# EAGLE design POV_2.0 (EAGLE 6.6.0)
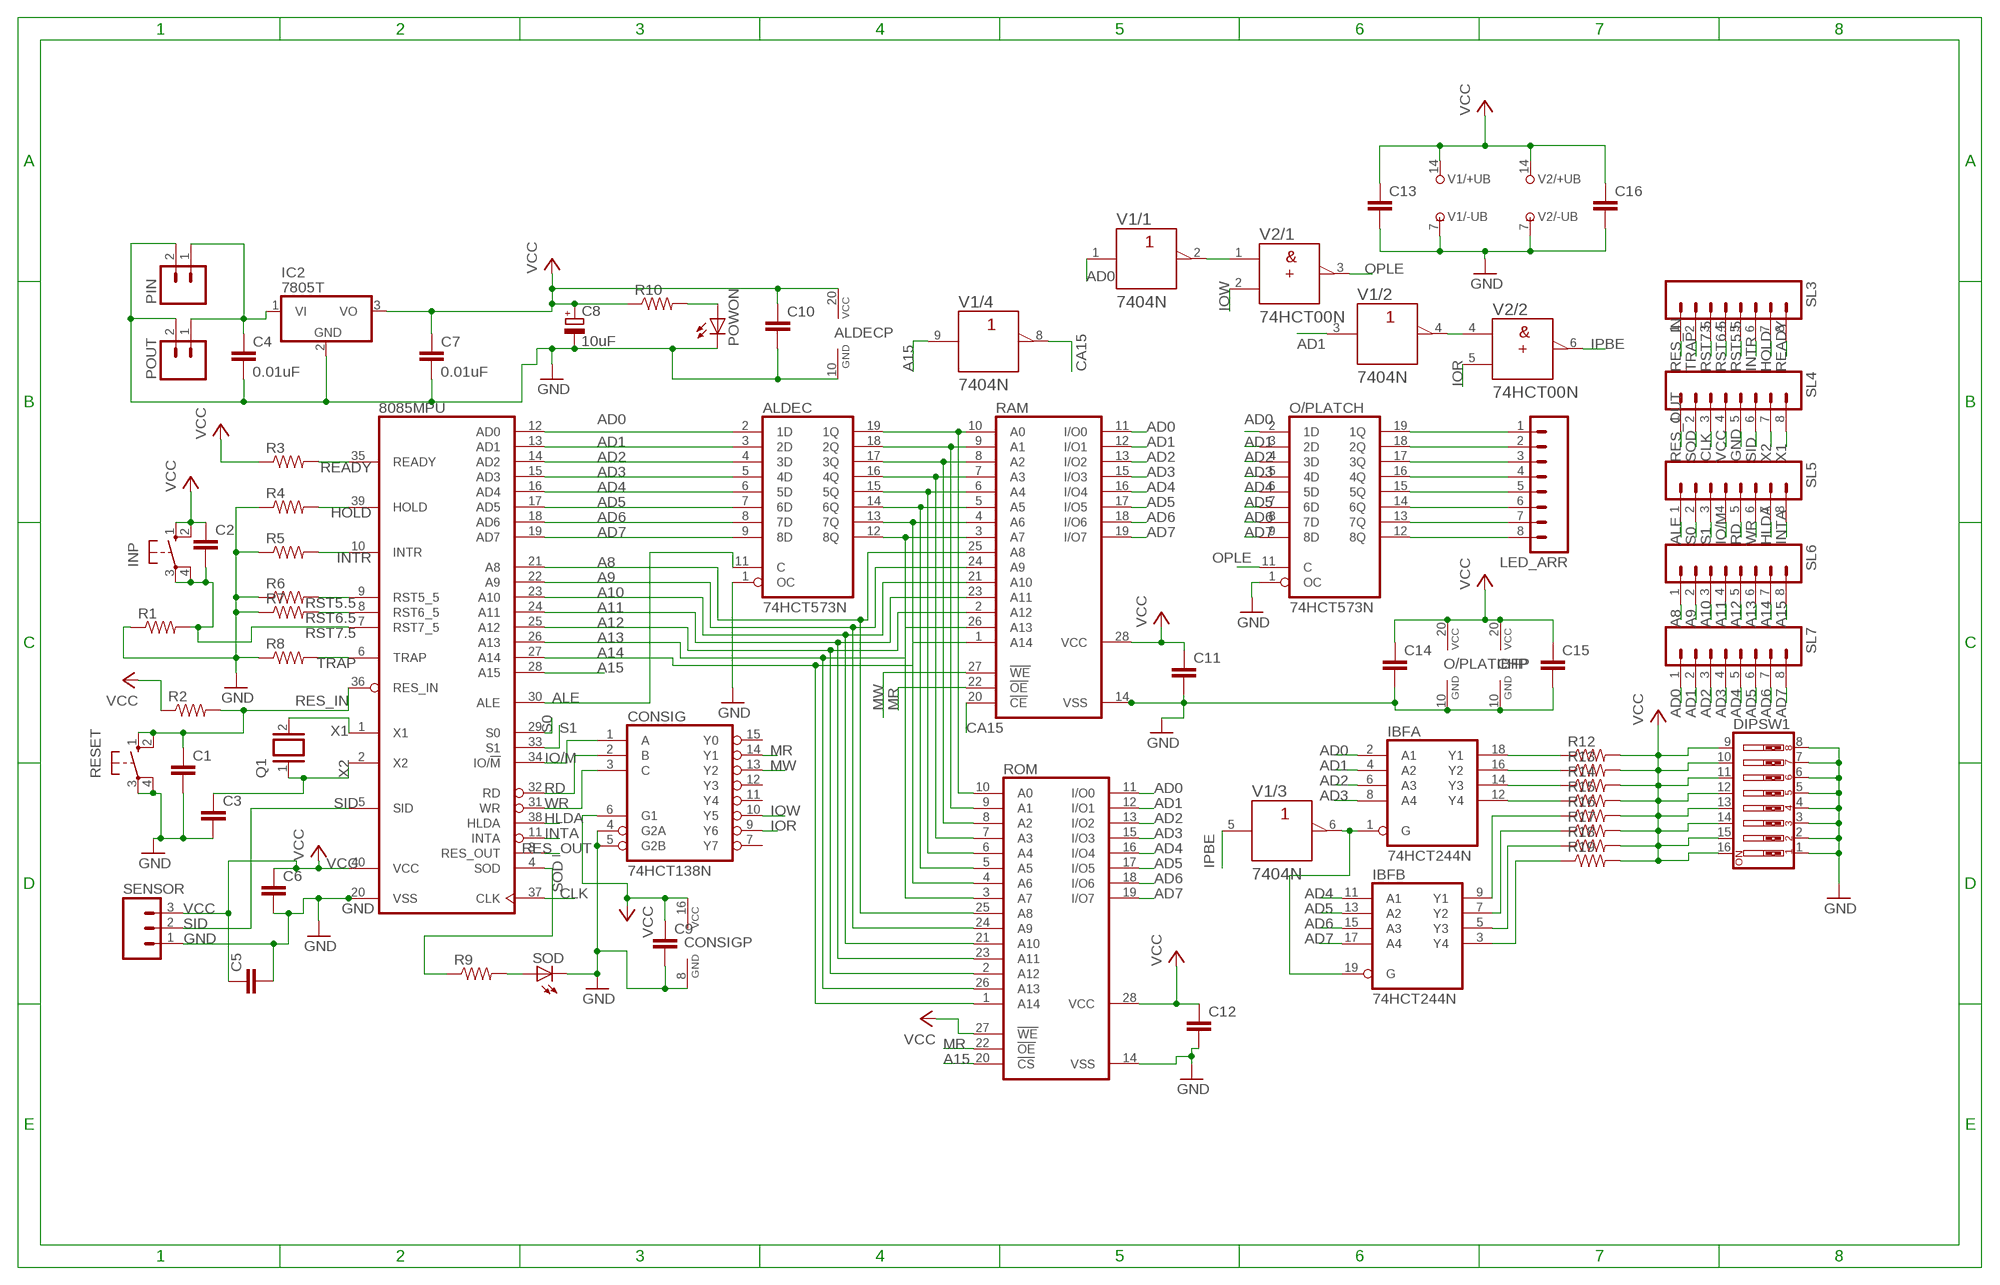
[diagram p0: schematic, sheet 1]

## Parts
8085MPU  8085  [DIL40]
ALDEC  74HCT573N  [DIL20]
C1  C-EU025-024X044  [C025-024X044]
C2  C-EU025-024X044  [C025-024X044]
C3  C-EU025-024X044  [C025-024X044]
C4  0.01uF  C-EU025-024X044  [C025-024X044]
C5  C-EU025-024X044  [C025-024X044]
C6  C-EU025-024X044  [C025-024X044]
C7  0.01uF  C-EU025-024X044  [C025-024X044]
C8  10uF  CPOL-EUE2,5-6E  [E2,5-6E]
C9  C-EU025-024X044  [C025-024X044]
C10  C-EU025-024X044  [C025-024X044]
C11  C-EU025-024X044  [C025-024X044]
C12  C-EU025-024X044  [C025-024X044]
C13  C-EU025-024X044  [C025-024X044]
C14  C-EU025-024X044  [C025-024X044]
C15  C-EU025-024X044  [C025-024X044]
C16  C-EU025-024X044  [C025-024X044]
CONSIG  74HCT138N  [DIL16]
DIPSW1  SW_DIP-8  [EDG-08]
IBF  74HCT244N  [DIL20]
IC2  7805T  [TO220H]
INP  10-XX  [B3F-10XX]
LED_ARR  M08  [08P]
O/PLATCH  74HCT573N  [DIL20]
PIN  M02  [02P]
POUT  M02  [02P]
POWON  LED5MM  [LED5MM]
Q1  XTAL/S  [QS]
R1  R-US_0204/7  [0204/7]
R2  R-US_0204/7  [0204/7]
R3  R-US_0204/7  [0204/7]
R4  R-US_0204/7  [0204/7]
R5  R-US_0204/7  [0204/7]
R6  R-US_0204/7  [0204/7]
R7  R-US_0204/7  [0204/7]
R8  R-US_0204/7  [0204/7]
R9  R-US_0204/7  [0204/7]
R10  R-US_0204/7  [0204/7]
R12  R-US_0204/7  [0204/7]
R13  R-US_0204/7  [0204/7]
R14  R-US_0204/7  [0204/7]
R15  R-US_0204/7  [0204/7]
R16  R-US_0204/7  [0204/7]
R17  R-US_0204/7  [0204/7]
R18  R-US_0204/7  [0204/7]
R19  R-US_0204/7  [0204/7]
RAM  58C256P  [DIL28-6]
RESET  10-XX  [B3F-10XX]
ROM  62256P  [DIL28-6]
SENSOR  M03  [03P]
SL3  M08  [08P]
SL4  M08  [08P]
SL5  M08  [08P]
SL6  M08  [08P]
SL7  M08  [08P]
SOD  LED5MM  [LED5MM]
V1  7404N  [DIL14]
V2  74HCT00N  [DIL14]

## Nets
A8: 8085MPU.21(A8) RAM.25(A8) ROM.25(A8) SL6.1
A9: 8085MPU.22(A9) RAM.24(A9) ROM.24(A9) SL6.2
A10: 8085MPU.23(A10) RAM.21(A10) ROM.21(A10) SL6.3
A11: 8085MPU.24(A11) RAM.23(A11) ROM.23(A11) SL6.4
A12: 8085MPU.25(A12) RAM.2(A12) ROM.2(A12) SL6.5
A13: 8085MPU.26(A13) RAM.26(A13) ROM.26(A13) SL6.6
A14: 8085MPU.27(A14) RAM.1(A14) ROM.1(A14) SL6.7
A15: 8085MPU.28(A15) ROM.20(!CS) SL6.8 V1.9(/4:A)
AD0: 8085MPU.12(AD0) ALDEC.2(1D) IBF.2(A:A1) O/PLATCH.2(1D) RAM.11(I/O0) ROM.11(I/O0) SL7.1 V1.1(/1:A)
AD1: 8085MPU.13(AD1) ALDEC.3(2D) IBF.4(A:A2) O/PLATCH.3(2D) RAM.12(I/O1) ROM.12(I/O1) SL7.2 V1.3(/2:A)
AD2: 8085MPU.14(AD2) ALDEC.4(3D) IBF.6(A:A3) O/PLATCH.4(3D) RAM.13(I/O2) ROM.13(I/O2) SL7.3
AD3: 8085MPU.15(AD3) ALDEC.5(4D) IBF.8(A:A4) O/PLATCH.5(4D) RAM.15(I/O3) ROM.15(I/O3) SL7.4
AD4: 8085MPU.16(AD4) ALDEC.6(5D) IBF.11(B:A1) O/PLATCH.6(5D) RAM.16(I/O4) ROM.16(I/O4) SL7.5
AD5: 8085MPU.17(AD5) ALDEC.7(6D) IBF.13(B:A2) O/PLATCH.7(6D) RAM.17(I/O5) ROM.17(I/O5) SL7.6
AD6: 8085MPU.18(AD6) ALDEC.8(7D) IBF.15(B:A3) O/PLATCH.8(7D) RAM.18(I/O6) ROM.18(I/O6) SL7.7
AD7: 8085MPU.19(AD7) ALDEC.9(8D) IBF.17(B:A4) O/PLATCH.9(8D) RAM.19(I/O7) ROM.19(I/O7) SL7.8
ALE: 8085MPU.30(ALE) ALDEC.11(C) SL5.1
CA15: RAM.20(!CE) V1.8(/4:Y)
CLK: 8085MPU.37(CLK) SL4.3
GND: 8085MPU.20(VSS) ALDEC.1(OC) ALDEC.10(GND) C1.2 C3.2 C4.2 C5.2 C6.2 C7.2 C8.- C9.2 C10.2 C11.2 C12.2 C13.2 C14.2 C15.2 C16.2 CONSIG.4(G2A) CONSIG.5(G2B) CONSIG.8(GND) DIPSW1.1 DIPSW1.2 DIPSW1.3 DIPSW1.4 DIPSW1.5 DIPSW1.6 DIPSW1.7 DIPSW1.8 IBF.10(P:GND) IC2.2(GND) O/PLATCH.1(OC) O/PLATCH.10(GND) PIN.2 POUT.2 POWON.K(C) R1.1 R4.1 R5.1 R6.1 R7.1 R8.1 RAM.14(VSS) RESET.3(P) RESET.4(P1) ROM.14(VSS) SENSOR.1 SL4.5 SOD.K(C) V1.7(/-UB:-UB) V2.7(/-UB:-UB)
HLDA: 8085MPU.38(HLDA) SL5.7
HOLD: 8085MPU.39(HOLD) R4.2 SL3.7
INTA: 8085MPU.11(INTA) SL5.8
INTR: 8085MPU.10(INTR) R5.2 SL3.6
IO/M: 8085MPU.34(IO/!M) CONSIG.1(A) SL5.4
IOR: CONSIG.9(Y6) V2.5(/2:B)
IOW: CONSIG.10(Y5) V2.2(/1:B)
IPBE: V1.5(/3:A) V2.6(/2:Y)
MR: CONSIG.14(Y1) RAM.22(!OE) ROM.22(!OE)
MW: CONSIG.13(Y2) RAM.27(!WE)
N$1: LED_ARR.1 O/PLATCH.19(1Q)
N$2: LED_ARR.2 O/PLATCH.18(2Q)
N$3: LED_ARR.3 O/PLATCH.17(3Q)
N$4: LED_ARR.4 O/PLATCH.16(4Q)
N$5: LED_ARR.5 O/PLATCH.15(5Q)
N$6: LED_ARR.6 O/PLATCH.14(6Q)
N$7: LED_ARR.7 O/PLATCH.13(7Q)
N$8: LED_ARR.8 O/PLATCH.12(8Q)
N$9: ALDEC.19(1Q) RAM.10(A0) ROM.10(A0)
N$10: ALDEC.18(2Q) RAM.9(A1) ROM.9(A1)
N$11: ALDEC.17(3Q) RAM.8(A2) ROM.8(A2)
N$12: ALDEC.16(4Q) RAM.7(A3) ROM.7(A3)
N$13: ALDEC.15(5Q) RAM.6(A4) ROM.6(A4)
N$14: ALDEC.14(6Q) RAM.5(A5) ROM.5(A5)
N$15: ALDEC.13(7Q) RAM.4(A6) ROM.4(A6)
N$16: ALDEC.12(8Q) RAM.3(A7) ROM.3(A7)
N$17: IBF.18(A:Y1) R12.1
N$18: IBF.16(A:Y2) R13.1
N$19: IBF.14(A:Y3) R14.1
N$20: IBF.12(A:Y4) R15.1
N$21: IBF.9(B:Y1) R16.1
N$22: IBF.7(B:Y2) R17.1
N$23: IBF.5(B:Y3) R18.1
N$24: IBF.1(A:G) IBF.19(B:G) V1.6(/3:Y)
N$25: IBF.3(B:Y4) R19.1
N$33: R9.2 SOD.A
N$42: C4.1 IC2.1(VI) PIN.1 POUT.1
N$44: POWON.A R10.2
N$46: V1.2(/1:Y) V2.1(/1:A)
N$50: V1.4(/2:Y) V2.4(/2:A)
OPLE: O/PLATCH.11(C) V2.3(/1:Y)
RD: 8085MPU.32(RD) CONSIG.2(B) SL5.5
READY: 8085MPU.35(READY) R3.2 SL3.8
RES_IN: 8085MPU.36(RES_IN) C1.1 R2.2 RESET.1(S) RESET.2(S1) SL3.1
RES_OUT: 8085MPU.3(RES_OUT) SL4.1
RST5.5: 8085MPU.9(RST5_5) R6.2 SL3.5
RST6.5: 8085MPU.8(RST6_5) R7.2 SL3.4
RST7.5: 8085MPU.7(RST7_5) C2.2 INP.3(P) INP.4(P1) R1.2 SL3.3
S0: 8085MPU.29(S0) SL5.2
S1: 8085MPU.33(S1) SL5.3
SID: 8085MPU.5(SID) SENSOR.2 SL4.6
SOD: 8085MPU.4(SOD) R9.1 SL4.2
TRAP: 8085MPU.6(TRAP) R8.2 SL3.2
VCC: 8085MPU.40(VCC) ALDEC.20(VCC) C2.1 C5.1 C6.1 C7.1 C8.+ C9.1 C10.1 C11.1 C12.1 C13.1 C14.1 C15.1 C16.1 CONSIG.6(G1) CONSIG.16(VCC) DIPSW1.9 DIPSW1.10 DIPSW1.11 DIPSW1.12 DIPSW1.13 DIPSW1.14 DIPSW1.15 DIPSW1.16 IBF.20(P:VCC) IC2.3(VO) INP.1(S) INP.2(S1) O/PLATCH.20(VCC) R2.1 R3.1 R10.1 R12.2 R13.2 R14.2 R15.2 R16.2 R17.2 R18.2 R19.2 RAM.28(VCC) ROM.27(!WE) ROM.28(VCC) SENSOR.3 SL4.4 V1.14(/+UB:+UB) V2.14(/+UB:+UB)
WR: 8085MPU.31(WR) CONSIG.3(C) SL5.6
X1: 8085MPU.1(X1) Q1.2 SL4.8
X2: 8085MPU.2(X2) C3.1 Q1.1 SL4.7
Unconnected: CONSIG.7(Y7) CONSIG.11(Y4) CONSIG.12(Y3) CONSIG.15(Y0) V1.10(/5:Y) V1.11(/5:A) V1.12(/6:Y) V1.13(/6:A) V2.8(/3:Y) V2.9(/3:A) V2.10(/3:B) V2.11(/4:Y) V2.12(/4:A) V2.13(/4:B)

## Library data of the parts
8085MPU = micro-intel:8085: MICROCOMPUTER/PERIPHERAL DEVICE; OC_FARNELL: unknown; OC_NEWARK: unknown
ALDEC O/PLATCH = 74xx-eu:74*573: 8-bit D latch BUS DRIVER
C1-C7 C9-C16 = rcl:C-EU: CAPACITOR, European symbol
C8 = rcl:CPOL-EU: POLARIZED CAPACITOR, European symbol
CONSIG = 74xx-eu:74*138: 3-line to 8-line DECODER/DEMULTIPLEXER
DIPSW1 = special:SW_DIP-8: DIP SWITCH
IBF = 74xx-eu:74*244: Octal BUFFER and LINE DRIVER, 3-state
IC2 = linear:78*: Positive VOLTAGE REGULATOR Source: http://cache.national.com/ds/LM/LM78L05.pdf http://www.fairchildsemi.com/ds/LM/LM7805.pdf
INP RESET = switch-omron:10-XX: OMRON SWITCH; MPN: B3F-1000; OC_FARNELL: 176432; OC_NEWARK: 36M3542
LED_ARR SL3-SL7 = con-amp-quick:M08: AMP QUICK CONNECTOR; OC_FARNELL: unknown; OC_NEWARK: unknown
PIN POUT = CEDTv83:M02: AMP QUICK CONNECTOR
POWON SOD = led:LED: LED OSRAM: - CHIPLED LG R971, LG N971, LY N971, LG Q971, LY Q971, LO R971, LY R971 LH N974, LH R974 LS Q976, LO Q976, LY Q976 LO Q996 - Hyper CHIPLED LW Q18S LB Q993, LB Q99A, LB R99A - SideLED LS A670, LO A670, LY A670, LG A670, LP A670 LB A673, LV A673, LT A673, LW A673 LH A674 LY A675 LS A676, LA A676, LO A676, LY A676, LW A676 LS A679, LY A679, LG A679 - Hyper Micro SIDELED® LS Y876, LA Y876, LO Y876, LY Y876 LT Y87S - SmartLED LW L88C, LW L88S LB L89C, LB L89S, LG L890 LS L89K, LO L89K, LY L89K LS L896, LA L896, LO L896, LY L896 - TOPLED LS T670, LO T670, LY T670, LG T670, LP T670 LSG T670, LSP T670, LSY T670, LOP T670, LYG T670 LG T671, LOG T671, LSG T671 LB T673, LV T673, LT T673, LW T673 LH T674 LS T676, LA T676, LO T676, LY T676, LB T676, LH T676, LSB T676, LW T676 LB T67C, LV T67C, LT T67C, LS T67K, LO T67K, LY T67K, LW E67C LS E67B, LA E67B, LO E67B, LY E67B, LB E67C, LV E67C, LT E67C LW T67C LS T679, LY T679, LG T679 LS T770, LO T770, LY T770, LG T770, LP T770 LB T773, LV T773, LT T773, LW T773 LH T774 LS E675, LA E675, LY E675, LS T675 LS T776, LA T776, LO T776, LY T776, LB T776 LHGB T686 LT T68C, LB T68C - Hyper Mini TOPLED® LB M676 - Mini TOPLED Santana® LG M470 LS M47K, LO M47K, LY M47K Source: http://www.osram.convergy.de LUXEON: - LUMILED® LXK2-PW12-R00, LXK2-PW12-S00, LXK2-PW14-U00, LXK2-PW14-V00 LXK2-PM12-R00, LXK2-PM12-S00, LXK2-PM14-U00 LXK2-PE12-Q00, LXK2-PE12-R00, LXK2-PE12-S00, LXK2-PE14-T00, LXK2-PE14-U00 LXK2-PB12-K00, LXK2-PB12-L00, LXK2-PB12-M00, LXK2-PB14-N00, LXK2-PB14-P00, LXK2-PB14-Q00 LXK2-PR12-L00, LXK2-PR12-M00, LXK2-PR14-Q00, LXK2-PR14-R00 LXK2-PD12-Q00, LXK2-PD12-R00, LXK2-PD12-S00 LXK2-PH12-R00, LXK2-PH12-S00 LXK2-PL12-P00, LXK2-PL12-Q00, LXK2-PL12-R00 Source: www.luxeon.com KINGBRIGHT: KA-3528ASYC Source: www.kingbright.com
Q1 = special:XTAL/S: CRYSTAL
R1-R10 R12-R19 = resistor:R-US_: RESISTOR, American symbol
RAM = memory-hitachi:58C256P: MEMORY; MPN: HN58C256AP85E; OC_FARNELL: 1496447; OC_NEWARK: 61M6616
ROM = memory-hitachi:62256P: MEMORY; OC_FARNELL: unknown; OC_NEWARK: unknown
SENSOR = con-amp-quick:M03: AMP QUICK CONNECTOR; OC_FARNELL: unknown; OC_NEWARK: unknown
V1 = 74ttl-din:74*04: Hex INVERTER
V2 = 74ttl-din:74*00: Quad 2-input NAND gate

## Net classes
0 default: width 0.406 mm, clearance 0.305 mm
1 VCC: width 0.61 mm, clearance 0.305 mm to class 0, clearance 0.305 mm
2 GND: width 0.61 mm, clearance 0.305 mm to class 0, clearance 0.305 mm to class 1, clearance 0.305 mm

## Board
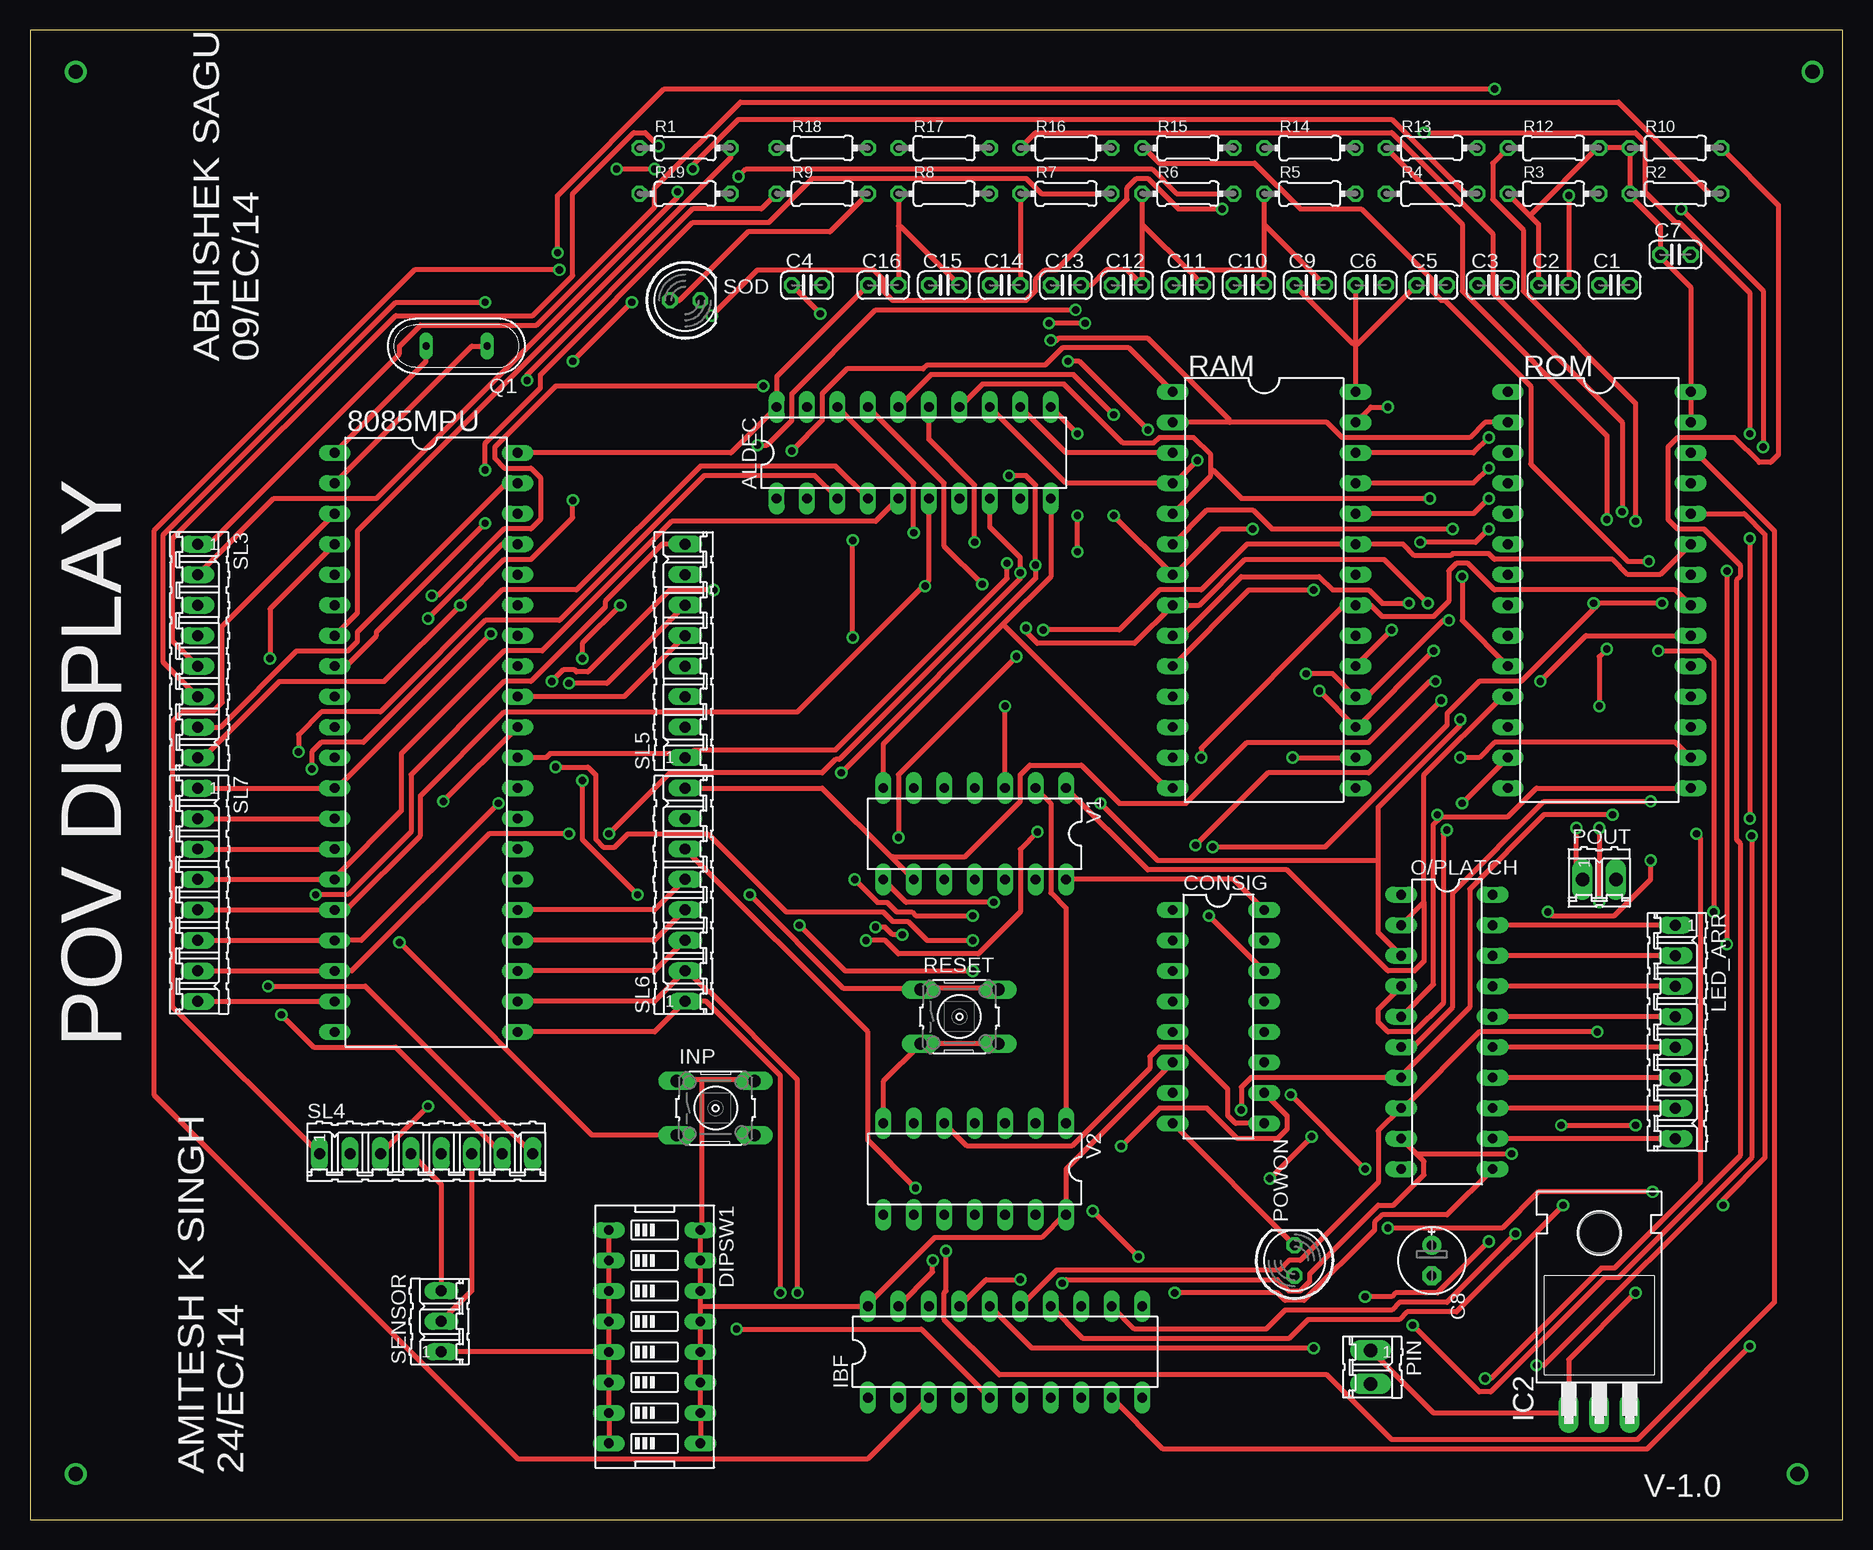
[diagram p1: board, top side]
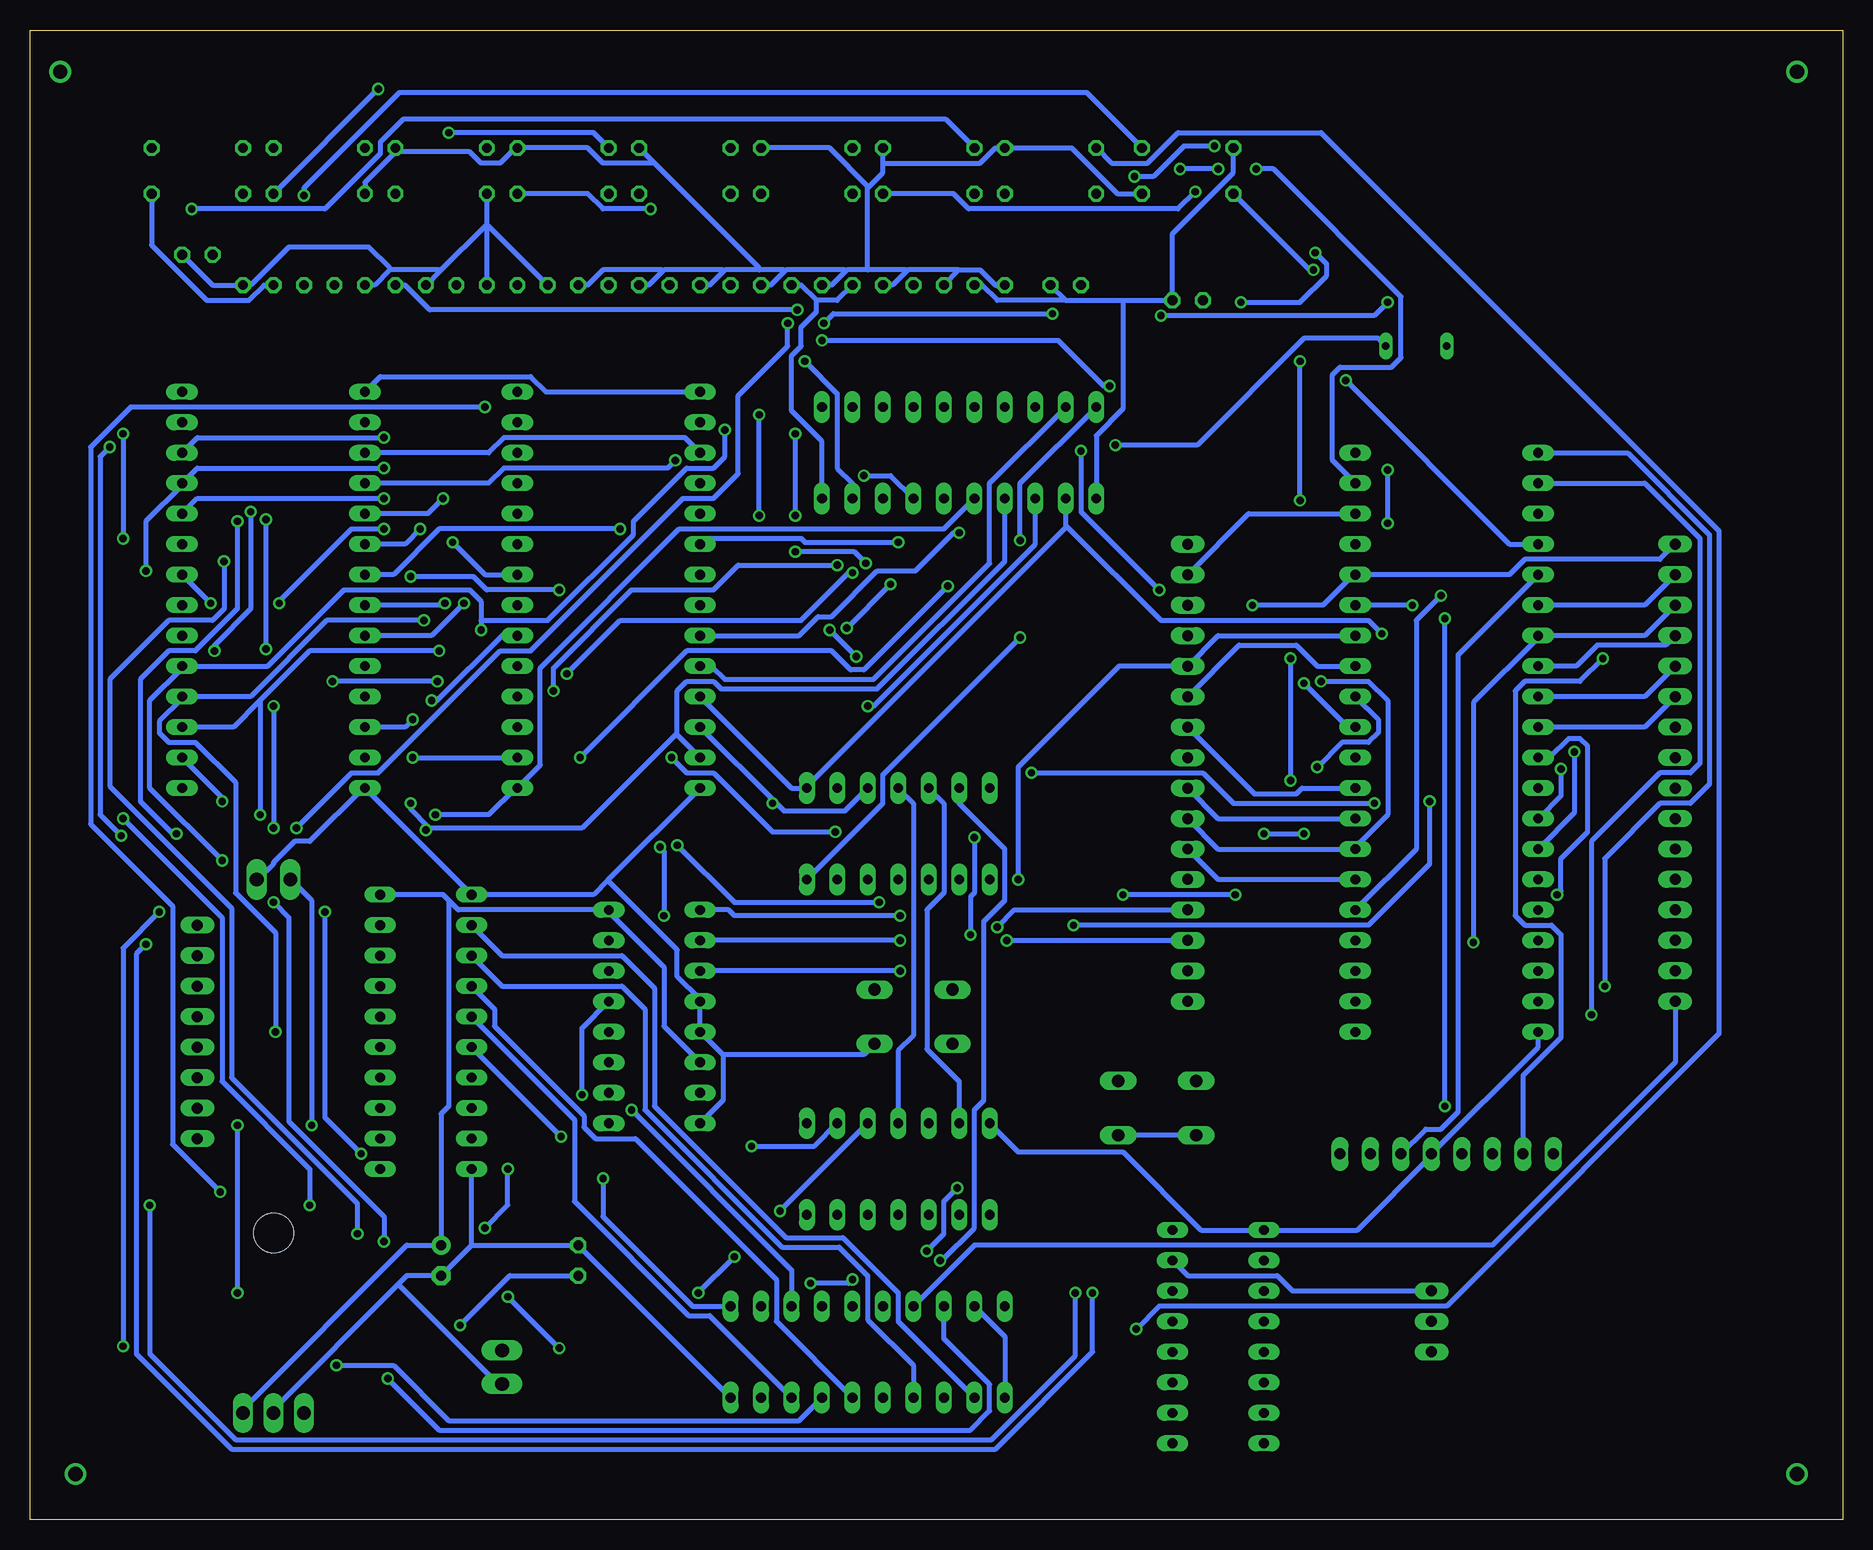
[diagram p2: board, bottom side, seen from below]

Size 151.11 x 124.13 mm. Coordinates in mm from the lower left corner, seen from the top.
Outline: 0,0 151.11,0 151.11,124.13 0,124.13 0,0
Copper layers (1*16): Top 0.035mm / dielectric 1.5mm / Bottom 0.035mm
Design rules "default": minimum track width 10mil, minimum drill 24mil, track to track 8mil, track to pad 8mil, pad to pad 8mil, via to via 8mil, smd to smd 8mil, copper to edge 40mil, drill to drill 8mil, minimum pad ring 10mil, minimum via ring 8mil, stop-mask expansion 4mil, vias tented up to drill 0mil, thermal gap 10mil

### Footprints (pad centres in the part's own frame; a part is rotated, then mirrored left to right if it is on the bottom)
DIL40 = drill 0.813 long: 1 -24.13,-7.62; 2 -21.59,-7.62; 3 -19.05,-7.62; 4 -16.51,-7.62; 5 -13.97,-7.62; 6 -11.43,-7.62; 7 -8.89,-7.62; 8 -6.35,-7.62; 9 -3.81,-7.62; 10 -1.27,-7.62; 11 1.27,-7.62; 12 3.81,-7.62; 13 6.35,-7.62; 14 8.89,-7.62; 15 11.43,-7.62; 16 13.97,-7.62; 17 16.51,-7.62; 18 19.05,-7.62; 19 21.59,-7.62; 20 24.13,-7.62; 21 24.13,7.62; 22 21.59,7.62; 23 19.05,7.62; 24 16.51,7.62; 25 13.97,7.62; 26 11.43,7.62; 27 8.89,7.62; 28 6.35,7.62; 29 3.81,7.62; 30 1.27,7.62; 31 -1.27,7.62; 32 -3.81,7.62; 33 -6.35,7.62; 34 -8.89,7.62; 35 -11.43,7.62; 36 -13.97,7.62; 37 -16.51,7.62; 38 -19.05,7.62; 39 -21.59,7.62; 40 -24.13,7.62
DIL20 = drill 0.813 long: 1 -11.43,-3.81; 2 -8.89,-3.81; 3 -6.35,-3.81; 4 -3.81,-3.81; 5 -1.27,-3.81; 6 1.27,-3.81; 7 3.81,-3.81; 8 6.35,-3.81; 9 8.89,-3.81; 10 11.43,-3.81; 11 11.43,3.81; 12 8.89,3.81; 13 6.35,3.81; 14 3.81,3.81; 15 1.27,3.81; 16 -1.27,3.81; 17 -3.81,3.81; 18 -6.35,3.81; 19 -8.89,3.81; 20 -11.43,3.81
C025-024X044 = drill 0.813 octagon: 1 -1.27,0; 2 1.27,0
E2,5-6E = drill 0.813 pad 1.575: + -1.27,0 | drill 0.813 pad 1.575 octagon: - 1.27,0
DIL16 = drill 0.813 long: 1 -8.89,-3.81; 2 -6.35,-3.81; 3 -3.81,-3.81; 4 -1.27,-3.81; 5 1.27,-3.81; 6 3.81,-3.81; 7 6.35,-3.81; 8 8.89,-3.81; 9 8.89,3.81; 10 6.35,3.81; 11 3.81,3.81; 12 1.27,3.81; 13 -1.27,3.81; 14 -3.81,3.81; 15 -6.35,3.81; 16 -8.89,3.81
EDG-08 = drill 0.813 long: 1 -8.89,-3.81; 2 -6.35,-3.81; 3 -3.81,-3.81; 4 -1.27,-3.81; 5 1.27,-3.81; 6 3.81,-3.81; 7 6.35,-3.81; 8 8.89,-3.81; 9 8.89,3.81; 10 6.35,3.81; 11 3.81,3.81; 12 1.27,3.81; 13 -1.27,3.81; 14 -3.81,3.81; 15 -6.35,3.81; 16 -8.89,3.81
TO220H = drill 1.118 long: 1 -2.54,-10.16; 2 0,-10.16; 3 2.54,-10.16 | hole 3.302: 0,4.826
B3F-10XX = drill 1.016 long: 1 -3.251,2.261; 2 3.251,2.261; 3 -3.251,-2.261; 4 3.251,-2.261
08P = drill 0.914 long: 1 -8.89,0; 2 -6.35,0; 3 -3.81,0; 4 -1.27,0; 5 1.27,0; 6 3.81,0; 7 6.35,0; 8 8.89,0
02P = drill 1.143 long: 1 -1.397,0; 2 1.397,0
LED5MM = drill 0.813 octagon: A -1.27,0; K 1.27,0
QS = drill 0.61 long: 1 -2.54,0; 2 2.54,0
0204/7 = drill 0.813 octagon: 1 -3.81,0; 2 3.81,0
DIL28-6 = drill 0.813 long: 1 -16.51,-7.62; 2 -13.97,-7.62; 3 -11.43,-7.62; 4 -8.89,-7.62; 5 -6.35,-7.62; 6 -3.81,-7.62; 7 -1.27,-7.62; 8 1.27,-7.62; 9 3.81,-7.62; 10 6.35,-7.62; 11 8.89,-7.62; 12 11.43,-7.62; 13 13.97,-7.62; 14 16.51,-7.62; 15 16.51,7.62; 16 13.97,7.62; 17 11.43,7.62; 18 8.89,7.62; 19 6.35,7.62; 20 3.81,7.62; 21 1.27,7.62; 22 -1.27,7.62; 23 -3.81,7.62; 24 -6.35,7.62; 25 -8.89,7.62; 26 -11.43,7.62; 27 -13.97,7.62; 28 -16.51,7.62
03P = drill 0.914 long: 1 -2.54,0; 2 0,0; 3 2.54,0
DIL14 = drill 0.813 long: 1 -7.62,-3.81; 2 -5.08,-3.81; 3 -2.54,-3.81; 4 0,-3.81; 5 2.54,-3.81; 6 5.08,-3.81; 7 7.62,-3.81; 8 7.62,3.81; 9 5.08,3.81; 10 2.54,3.81; 11 0,3.81; 12 -2.54,3.81; 13 -5.08,3.81; 14 -7.62,3.81

### Placement (x,y rotation side)
8085MPU  33.02,64.77 270 top
ALDEC  73.66,88.9 0 top
C1  132.08,102.87 0 top
C2  127,102.87 0 top
C3  121.92,102.87 0 top
C4  64.77,102.87 0 top
C5  116.84,102.87 0 top
C6  111.76,102.87 0 top
C7  137.16,105.41 0 top
C8  116.84,21.59 270 top
C9  106.68,102.87 0 top
C10  101.6,102.87 0 top
C11  96.52,102.87 0 top
C12  91.44,102.87 0 top
C13  86.36,102.87 0 top
C14  81.28,102.87 0 top
C15  76.2,102.87 0 top
C16  71.12,102.87 0 top
CONSIG  99.06,41.91 270 top
DIPSW1  52.07,15.24 270 top
IBF  81.28,13.97 0 top
IC2  130.81,19.05 0 top
INP  57.15,34.29 0 top
LED_ARR  137.16,40.64 270 top
O/PLATCH  118.11,40.64 270 top
PIN  111.76,12.7 270 top
POUT  130.81,53.34 0 top
POWON  105.41,21.59 90 top
Q1  35.56,97.79 180 top
R1  54.61,114.3 0 top
R2  137.16,110.49 0 top
R3  127,110.49 0 top
R4  116.84,110.49 0 top
R5  106.68,110.49 0 top
R6  96.52,110.49 0 top
R7  86.36,110.49 0 top
R8  76.2,110.49 0 top
R9  66.04,110.49 0 top
R10  137.16,114.3 0 top
R12  127,114.3 0 top
R13  116.84,114.3 0 top
R14  106.68,114.3 0 top
R15  96.52,114.3 0 top
R16  86.36,114.3 0 top
R17  76.2,114.3 0 top
R18  66.04,114.3 0 top
R19  54.61,110.49 0 top
RAM  102.87,77.47 270 top
RESET  77.47,41.91 0 top
ROM  130.81,77.47 270 top
SENSOR  34.29,16.51 90 top
SL3  13.97,72.39 270 top
SL4  33.02,30.48 0 top
SL5  54.61,72.39 90 top
SL6  54.61,52.07 90 top
SL7  13.97,52.07 270 top
SOD  54.61,101.6 0 top
V1  78.74,57.15 180 top
V2  78.74,29.21 180 top

### Tracks (layer width: path | path; a pad name or v marks a point on that pad's centre or on a via)
A8  (via drill 0.61)
  Top 0.406: 8085MPU.21 52.07,40.64 SL6.1 56.36,43.18 62.55,36.99 v62.55,18.89 | RAM.25 120.33,86.36 v121.6,87.63 | v141.45,79.06 v141.45,47.94
  Bottom 0.406: v121.6,87.63 137.16,87.63 ROM.25 138.43,86.2 141.45,83.19 v141.45,79.06 | v62.55,18.89 62.55,13.97 70.64,5.87 134.3,5.87 142.24,13.81 142.24,47.15 v141.45,47.94
A9  (via drill 0.61)
  Top 0.406: 8085MPU.22 52.07,43.18 SL6.2 54.77,45.72 56.52,43.97 56.67,43.97 63.98,36.67 v63.98,18.89 | RAM.24 120.33,83.82 v121.6,85.09 | v141.13,26.19 141.13,26.67 144.62,30.16 144.62,82.07 142.88,83.82 ROM.24
  Bottom 0.406: v121.6,85.09 137.16,85.09 ROM.24 | v63.98,18.89 63.98,13.65 70.96,6.67 133.99,6.67 141.13,13.81 v141.13,26.19
A10  (via drill 0.61)
  Top 0.406: 8085MPU.23 52.07,45.72 SL6.3 | ROM.21 137.16,77.47 122.08,77.47 119.86,79.69 118.9,79.69 118.27,79.06 118.27,76.52 117,75.25 112.71,75.25 111.76,76.2 RAM.21 109.54,76.2 97.63,64.29 v97.63,63.5 | v69.69,48.26 71.28,48.26 72.39,47.15 79.06,47.15 82.55,50.64 82.55,55.88 v83.98,57.31
  Bottom 0.406: v69.69,48.26 SL6.3 | v83.98,57.31 89.22,57.31 94.14,62.23 96.36,62.23 v97.63,63.5
A11  (via drill 0.61)
  Top 0.406: 8085MPU.24 52.07,48.26 SL6.4 | ROM.23 135.89,78.74 133.19,78.74 131.92,80.01 122.08,80.01 121.6,80.49 118.59,80.49 118.43,80.33 115.41,80.33 114.46,81.28 RAM.23 101.44,81.28 97.63,77.47 94.14,77.47 90.8,74.14 v84.45,74.14 | v70.48,49.37 71.28,49.37 71.91,48.74 v72.71,48.74 | v72.39,56.83 72.39,62.07 v82.23,71.91
  Bottom 0.406: SL6.4 69.06,50.8 v70.48,49.37 | v72.71,48.74 72.71,51.91 72.39,52.23 v72.39,56.83 | v84.45,74.14 v82.23,71.91
A12  (via drill 0.61)
  Top 0.406: 8085MPU.25 52.07,50.8 SL6.5 | 100.01,91.44 108.11,91.44 109.38,90.17 120.02,90.17 121.29,91.44 ROM.2 | 100.01,91.44 RAM.2 | v33.5,76.99 33.97,76.99 39.53,82.55 41.75,82.55 42.55,83.34 42.55,86.84 41.75,87.63 39.53,87.63 38.73,88.42 38.73,89.38 43.81,94.46 v61.12,94.46 | v85.09,98.27 85.57,98.27 85.72,98.42 93.19,98.42 100.01,91.6 100.01,91.44
  Bottom 0.406: 8085MPU.25 35.56,55.88 35.56,74.93 v33.5,76.99 | v61.12,94.46 61.59,94.46 65.41,98.27 v85.09,98.27
A13  (via drill 0.61)
  Top 0.406: RAM.26 120.33,88.9 v121.6,90.17 | SL6.6 69.85,40.64 69.85,31.59 v73.82,27.62 | v76.36,22.38 76.36,19.05 76.2,18.89 76.2,16.67 80.8,12.06 108.11,12.06 113.51,6.67 133.99,6.67 145.42,18.1 145.42,82.39 138.91,88.9 ROM.26
  Bottom 0.406: 8085MPU.26 52.07,53.34 SL6.6 | v121.6,90.17 137.16,90.17 ROM.26 | v73.82,27.62 74.93,26.51 74.93,23.81 v76.36,22.38
A14  (via drill 0.61)
  Top 0.406: v43.5,69.85 44.45,70.8 45.4,70.8 45.56,70.64 46.51,70.64 53.34,77.47 v56.99,77.47 | v63.5,89.06 66.04,91.6 66.04,93.82 68.1,95.89 74.45,95.89 74.77,96.2 84.61,96.2 86.04,97.63 91.6,97.63 RAM.1
  Bottom 0.406: SL6.7 52.07,55.88 8085MPU.27 40.64,56.04 37.94,58.74 37.94,68.26 39.53,69.85 v43.5,69.85 | RAM.1 108.11,93.98 109.38,95.25 121.92,95.25 ROM.1 | v56.99,77.47 63.5,83.98 v63.5,89.06
A15  (via drill 0.61)
  Top 0.406: 71.83,55.17 66.04,60.96 SL6.8 | 71.83,55.17 V1.9 | ROM.20 129.7,73.66 v125.89,69.85 | v117.16,69.85 116.68,69.85 111.6,64.77 101.44,64.77 96.36,59.69 90.8,59.69 87.63,62.87 83.34,62.87 82.55,62.07 82.55,59.85 77.95,55.24 71.91,55.24 71.83,55.17
  Bottom 0.406: 8085MPU.28 52.07,58.42 SL6.8 | v117.16,69.85 v125.89,69.85
AD0  (via drill 0.61)
  Top 0.406: SL7.1 8085MPU.12 25.56,60.96 v38.42,73.82 | ROM.11 122.71,68.58 116.2,62.07 116.2,51.44 | O/PLATCH.2 116.2,51.44 | V1.1 93.19,54.13 104.77,54.13 113.19,45.72 115.41,45.72 116.2,46.51 116.2,51.44
  Bottom 0.406: RAM.11 87.63,60.96 V1.1 86.36,61.12 64.77,82.71 | 64.77,82.71 ALDEC.2 | v38.42,73.82 39.53,74.93 56.83,74.93 64.61,82.71 64.77,82.71 | IBF.2 78.74,16.51 78.74,18.89 83.34,23.5 88.11,23.5 99.06,34.45 99.06,44.29 101.76,46.99 111.76,46.99 O/PLATCH.2
AD1  (via drill 0.61)
  Top 0.406: v119.22,66.67 119.22,66.2 112.39,59.37 112.39,54.93 | 112.39,54.93 112.39,48.9 O/PLATCH.3 | SL7.2 8085MPU.13 | V1.3 v81.28,67.79 | v23.5,62.55 23.5,63.98 24.29,64.77 27.78,64.77 37.94,74.93 44.13,74.93 56.2,87 65.41,87 ALDEC.3 | 112.39,54.93 93.98,54.93 v89.22,59.69
  Bottom 0.406: IBF.4 77.47,12.86 81.28,16.67 81.28,20.32 83.66,22.7 88.42,22.7 99.85,34.13 99.85,42.55 101.76,44.45 111.76,44.45 O/PLATCH.3 | ROM.12 119.86,66.04 v119.22,66.67 | V1.3 83.19,59.05 88.27,59.05 88.98,59.77 | RAM.12 88.98,59.77 | ALDEC.3 67.31,81.28 80.8,67.79 v81.28,67.79 | 8085MPU.13 23.5,60.33 v23.5,62.55 | v89.22,59.69 89.06,59.69 88.98,59.77
AD2  (via drill 0.61)
  Top 0.406: SL7.3 8085MPU.14 | v119.38,59.69 ROM.13 | v22.38,63.98 22.38,65.41 24.29,67.31 29.21,67.31 39.37,77.47 45.56,77.47 55.88,87.79 67.15,87.79 ALDEC.4 | O/PLATCH.4 112.39,42.55 112.39,41.43 113.19,40.64 115.41,40.64 117.79,43.02 117.79,57.15 v118.11,57.47
  Bottom 0.406: IBF.6 88.9,16.51 88.9,20 100.65,31.75 103.98,31.75 104.93,32.7 104.93,33.66 112.39,41.12 112.39,42.55 O/PLATCH.4 | ALDEC.4 69.85,79.85 80.49,69.22 93.5,69.22 94.14,69.85 96.36,69.85 97.16,69.06 97.16,65.41 | RAM.13 97.16,65.41 | v119.38,59.69 119.38,59.21 117.87,57.71 | 117.87,57.71 117.79,57.63 105.09,57.63 97.31,65.41 97.16,65.41 | 8085MPU.14 22.38,58.9 v22.38,63.98 | 117.87,57.71 v118.11,57.47
AD3  (via drill 0.61)
  Top 0.406: ROM.15 125.57,60.96 123.19,58.58 117.63,58.58 | 117.63,58.58 117,57.94 117,44.61 O/PLATCH.5 | SL7.4 8085MPU.15 25.4,53.5 30.96,59.05 30.96,63.82 39.53,72.39 42.7,72.39 53.5,83.19 70.48,83.19 ALDEC.5 | v117.32,58.74 117.48,58.58 117.63,58.58
  Bottom 0.406: IBF.8 94.46,16.99 96.2,16.99 105.73,26.51 105.73,33.34 O/PLATCH.5 | ALDEC.5 74.93,82.55 97,82.55 108.58,70.96 108.58,62.87 RAM.15 110.65,60.96 112.87,58.74 v117.32,58.74
AD4  (via drill 0.61)
  Top 0.406: v119.22,63.5 120.81,63.5 122.08,64.77 137.16,64.77 ROM.16 | v106.84,31.91 v103.35,28.42 | v135.1,59.85 126.21,59.85 118.59,52.23 118.59,42.7 115.25,39.37 O/PLATCH.6 | SL7.5 8085MPU.16 26.35,50.8 32.54,56.99 32.54,60.33 39.53,67.31 63.98,67.31 74.53,77.87 | ALDEC.6 74.93,78.26 74.53,77.87 | v105.25,63.5 RAM.16 | v74.61,77.79 74.53,77.87
  Bottom 0.406: v119.22,63.5 RAM.16 | IBF.11 95.88,17.78 103.35,25.24 v103.35,28.42 | O/PLATCH.6 v106.84,31.91 | ROM.16 135.1,60.17 v135.1,59.85 | v105.25,63.5 96.36,72.39 84.3,72.39 82.71,70.8 81.6,70.8 v74.61,77.79
AD5  (via drill 0.61)
  Top 0.406: v100.97,34.13 100.97,36.04 101.76,36.83 O/PLATCH.7 114.3,36.99 120.02,42.7 120.02,52.55 126.21,58.74 v131.92,58.74 | SL7.6 8085MPU.17 27.62,48.26 v39.05,59.69 | v81.6,87 83.03,87 83.82,86.2 v83.82,79.53 83.82,78.42 v67.63,62.23 | v107.47,69.06 RAM.17 110.65,66.04 v117,72.39
  Bottom 0.406: IBF.13 87.63,20.8 v100.97,34.13 | ALDEC.7 79.38,87 v81.6,87 | v83.82,79.53 92.08,79.53 94.14,77.47 100.97,77.47 107.47,70.96 v107.47,69.06 | ROM.17 134.14,66.04 132,68.18 | 132,68.18 127.79,72.39 v117,72.39 | v39.05,59.69 50.8,59.69 53.34,62.23 v67.63,62.23 | v131.92,58.74 131.92,68.1 132,68.18
AD6  (via drill 0.61)
  Top 0.406: IBF.15 85.57,20.8 104.14,20.8 104.93,21.59 105.89,21.59 112.39,28.1 112.39,32.38 O/PLATCH.8 114.46,34.29 120.81,40.64 v130.65,40.64 | SL7.7 8085MPU.18 26.83,45.72 38.26,57.15 v44.93,57.15 | ALDEC.8 80.01,82.71 82.55,80.17 v82.55,78.9 82.55,78.42 67.47,63.34 67.15,63.34 66.04,62.23 53.34,62.23 v48.26,57.15 | v106.36,70.48 108.58,70.48 RAM.18 111.44,68.58 117.79,74.93 v118.27,74.93
  Bottom 0.406: v82.55,78.9 82.87,78.9 86.84,74.93 101.92,74.93 v106.36,70.48 | v118.27,74.93 126.36,74.93 132.72,68.58 ROM.18 138.43,68.42 140.34,66.52 140.34,65.56 139.54,64.77 137.32,64.77 133.99,61.44 133.99,52.23 130.65,48.9 v130.65,40.64 | v48.26,57.15 v44.93,57.15
AD7  (via drill 0.61)
  Top 0.406: v113.51,74.14 RAM.19 | v86.52,96.52 87.47,96.52 v93.19,90.81 | 115.65,30.4 116.2,29.84 116.2,28.73 113.66,26.19 112.39,26.19 106.68,20.48 106.68,19.84 105.89,19.05 104.93,19.05 103.98,20 86.36,20 v86.04,19.68 | 115.65,30.4 O/PLATCH.9 | v82.55,20 79.69,20 IBF.17 | SL7.8 8085MPU.19 | v135.1,54.93 135.1,53.34 132.08,50.32 126.84,50.32 v126.52,50.64 | v123.51,30.48 115.73,30.48 115.65,30.4
  Bottom 0.406: 113.51,74.93 113.51,76.52 114.46,77.47 124.94,77.47 131.29,71.12 ROM.19 138.43,70.96 141.13,68.26 141.13,60.96 v135.1,54.93 | 113.51,74.93 v113.51,74.14 | ALDEC.9 82.55,86.36 83.82,87.63 83.82,93.82 v86.52,96.52 | v93.19,90.81 93.19,88.58 94.14,87.63 96.36,87.63 100.81,83.19 100.81,82.07 107.95,74.93 113.51,74.93 | IBF.17 72.39,22.86 29.21,22.86 13.97,38.1 SL7.8 | v86.04,19.68 82.87,19.68 v82.55,20 | v126.52,50.64 126.52,33.5 v123.51,30.48
ALE  (via drill 0.61)
  Top 0.406: 8085MPU.30 43.02,63.5 43.34,63.82 54.29,63.82 SL5.1 54.77,63.5 55.4,64.14 67.15,64.14 81.44,78.42 v81.44,79.69 | v87.31,90.49 ALDEC.11 | v87.31,80.64 v87.31,83.66
  Bottom 0.406: v87.31,83.66 v87.31,90.49 | v87.31,80.64 82.39,80.64 v81.44,79.69
CA15  (via drill 0.61)
  Top 0.406: V1.8 73.02,51.44 v80.33,51.44 | v97.16,56.2 103.19,62.23 111.6,62.23 v117.63,68.26
  Bottom 0.406: v80.33,51.44 92.39,51.44 v97.16,56.2 | v117.63,68.26 117.16,68.26 111.76,73.66 RAM.20
CLK  (via drill 0.61)
  Top 0.406: 8085MPU.37 39.37,81.28 v33.18,75.09 | SL4.3 v33.18,34.45
  Bottom 0.406: v33.18,34.45 v33.18,75.09
GND
  Top 0.406: R5.1 102.87,107.79 | 102.87,107.79 102.87,104.14 | 102.87,104.14 C10.2 | C9.2 103.03,107.79 102.87,107.79 | C13.2 88.42,102.87 89.69,104.14 91.44,104.14 C12.2 92.71,107.79 | 92.71,107.79 R6.1 | 96.6,104.06 92.87,107.79 92.71,107.79 | 96.6,104.06 C11.2 | 102.87,104.14 96.68,104.14 96.6,104.06 | R7.1 82.55,104.14 | 82.55,104.14 C14.2 | R8.1 72.39,107.79 | 72.39,107.79 C16.2 | 76.28,104.06 72.55,107.79 72.39,107.79 | 76.28,104.06 C15.2 | 82.55,104.14 76.36,104.14 76.28,104.06 | V1.7 71.12,64.61 81.12,74.61 | 81.12,74.61 85.09,78.58 ALDEC.10 | RAM.14 94.77,60.96 81.12,74.61 | DIPSW1.8 DIPSW1.7 DIPSW1.6 DIPSW1.5 | DIPSW1.5 DIPSW1.4 DIPSW1.3 DIPSW1.2 DIPSW1.1 | DIPSW1.5 SENSOR.1 | V2.7 71.12,36.51 74.14,39.53 RESET.3 74.3,39.69 80.64,39.69 RESET.4 | POWON.K CONSIG.8
  Bottom 0.406: C7.2 135.89,102.87 C1.2 132.72,102.87 129.54,106.05 122.87,106.05 121.13,104.3 121.13,104.14 | R4.1 113.03,107.79 | 113.03,107.79 C6.2 | 116.92,104.06 113.19,107.79 113.03,107.79 | 116.92,104.06 C5.2 | C3.2 122.4,102.87 121.13,104.14 | 121.13,104.14 117,104.14 116.92,104.06 | C9.2 112.87,107.79 113.03,107.79 | 64.77,101.6 60.01,101.6 | 60.01,101.6 SOD.K 55.88,107.16 50.8,112.24 R1.1 | C4.2 64.77,101.6 | ALDEC.1 62.23,90.33 60.01,92.55 60.01,101.6 | C16.2 71.75,102.87 70.48,101.6 64.77,101.6 | C13.2 86.84,102.87 85.57,101.6 | 85.57,101.6 83.82,101.6 C14.2 | POUT.2 132.08,53.34 130.81,54.61 130.81,54.77 129.06,56.52 127.79,56.52 123.35,60.96 ROM.14 O/PLATCH.1 104.14,52.07 102.95,53.26 | RAM.14 102.95,53.26 | 8085MPU.20 25.4,39.37 SL4.5 34.29,30.32 40.48,24.13 DIPSW1.1 53.5,24.13 60.01,30.64 68.74,30.64 V2.7 | CONSIG.8 93.34,34.92 93.34,38.73 | 93.34,38.73 CONSIG.5 CONSIG.4 95.25,43.34 97.16,45.24 97.16,47.47 102.95,53.26 | 93.34,38.73 81.6,38.73 80.8,39.53 RESET.4 | IBF.10 POWON.K 114.3,22.86 | 114.3,22.86 O/PLATCH.10 | 114.3,22.86 C8.- 119.7,20.32 120.41,19.61 | IC2.2 130.81,9.21 120.41,19.61 | 120.41,19.61 112.24,11.43 111.76,11.43 PIN.2 | 85.57,101.6 85.57,100.65 86.84,99.38 86.84,97.79 87.63,97 87.63,92.39 85.09,89.85 ALDEC.10
HLDA
  Bottom 0.406: 8085MPU.38 49.53,83.82 SL5.7
HOLD  (via drill 0.61)
  Top 0.406: 8085MPU.39 39.69,86.36 27.31,73.98 27.31,73.18 26.51,72.39 22.22,72.39 15.88,66.04 SL3.7 | R4.2 119.7,110.49 113.51,116.68 59.05,116.68 55.24,112.87 v55.24,112.55 | v48.89,112.55 v52.07,112.55
  Bottom 0.406: v52.07,112.55 v55.24,112.55 | v48.89,112.55 47.47,112.55 36.83,101.92 36.83,96.84 37.62,96.04 41.91,96.04 42.55,95.41 42.55,88.27 8085MPU.39
INTA  (via drill 0.61)
  Top 0.406: v23.81,52.07 26.51,52.07 31.75,57.31 31.75,62.07 39.53,69.85 41.75,69.85 47.94,76.04 47.94,76.52 52.7,81.28 SL5.8
  Bottom 0.406: 8085MPU.11 24.45,63.5 22.86,65.09 21.91,65.09 21.27,64.45 21.27,57.31 23.5,55.09 23.5,52.39 v23.81,52.07
INTR  (via drill 0.61)
  Top 0.406: v99.38,109.22 95.73,109.22 93.19,111.76 92.23,111.76 91.44,110.97 91.44,110.01 85.57,104.14 84.61,104.14 83.82,103.35 83.82,102.39 83.03,101.6 71.91,101.6 71.12,102.39 71.12,103.35 70.33,104.14 60.64,104.14 v56.83,100.33 | v37.94,101.44 30.48,101.44 11.11,82.07 11.11,71.44 SL3.6
  Bottom 0.406: 8085MPU.10 16.51,66.04 SL3.6 | R5.2 104.62,110.49 103.35,109.22 v99.38,109.22 | v56.83,100.33 39.05,100.33 v37.94,101.44
IO/M  (via drill 0.61)
  Top 0.406: v78.58,50.32 73.82,50.32 73.5,50.64 72.23,50.64 71.44,51.44 70.64,51.44 v68.74,53.34
  Bottom 0.406: 8085MPU.34 52.07,73.66 SL5.4 60.33,71.12 68.74,62.71 v68.74,53.34 | CONSIG.1 92.87,50.8 92.39,50.32 v78.58,50.32
IOR
  Top 0.406: V2.5 78.11,31.11 86.84,31.11 93.34,37.62 93.34,38.58 94.14,39.37 96.36,39.37 99.85,35.88 99.85,33.66 100.49,33.02 CONSIG.9
IOW  (via drill 0.61)
  Top 0.406: v90.96,31.11 94.14,34.29 98.11,34.29 100.65,31.75 103.98,31.75 104.77,32.54 104.77,33.66 CONSIG.10
  Bottom 0.406: V2.2 85.72,31.11 v90.96,31.11
IPBE
  Bottom 0.406: V2.6 73.66,36.51 76.36,39.21 76.36,50.8 74.93,52.23 74.93,59.69 V1.5
MR  (via drill 0.61)
  Top 0.406: v98.27,50.32 CONSIG.14 | v98.58,56.04 107.95,56.04 118.11,66.2 118.11,67.15 120.81,69.85 124.3,69.85 130.57,76.12 | 130.57,76.12 130.81,76.36 v136.05,76.36 | v115.89,81.44 120.49,81.44 v121.6,82.55 | 130.57,76.12 v130.33,76.36
  Bottom 0.406: v98.27,50.32 98.27,55.72 v98.58,56.04 | ROM.22 v136.05,76.36 | RAM.22 113.19,78.74 v115.89,81.44 | v121.6,82.55 124.3,82.55 130.33,76.52 v130.33,76.36
MW  (via drill 0.61)
  Top 0.406: v111.28,29.21 v105.09,35.4 | v113.19,24.29 122.71,24.29 125.73,27.3 v135.26,27.3 | v113.19,92.71 111.76,92.71 RAM.27
  Bottom 0.406: CONSIG.13 105.09,40.96 v105.09,35.4 | v111.28,29.21 111.28,26.19 v113.19,24.29 | v135.26,27.3 139.22,31.27 139.22,51.12 146.05,57.94 146.05,89.38 142.72,92.71 v113.19,92.71
N$1
  Top 0.406: LED_ARR.1 O/PLATCH.19
N$2
  Top 0.406: LED_ARR.2 O/PLATCH.18
N$3
  Top 0.406: LED_ARR.3 O/PLATCH.17
N$4
  Top 0.406: LED_ARR.4 O/PLATCH.16
N$5
  Top 0.406: LED_ARR.5 O/PLATCH.15
N$6
  Top 0.406: LED_ARR.6 O/PLATCH.14
N$7
  Top 0.406: LED_ARR.7 O/PLATCH.13
N$8
  Top 0.406: LED_ARR.8 O/PLATCH.12
N$9  (via drill 0.61)
  Top 0.406: ROM.10 119.38,74.93 v119.38,78.58 | v107,77.47 101.6,77.47 RAM.10
  Bottom 0.406: ALDEC.19 71.12,86.36 71.12,79.69 80.8,70.01 93.19,70.01 94.3,71.12 RAM.10 | v119.38,78.58 114.14,78.58 113.03,77.47 v107,77.47
N$10  (via drill 0.61)
  Top 0.406: ALDEC.18 73.66,86.36 v73.66,82.23 | v114.94,76.36 112.71,76.36 111.6,77.47 108.58,77.47 107.47,78.58 100.97,78.58 96.04,73.66 RAM.9
  Bottom 0.406: v73.66,82.23 74.14,82.23 77.31,79.06 80.49,79.06 84.3,75.25 85.41,75.25 86.99,73.66 RAM.9 | ROM.9 117.63,73.66 v114.94,76.36
N$11  (via drill 0.61)
  Top 0.406: ALDEC.17 76.2,86.36 76.2,81.12 v79.38,77.95 | v83.03,74.3 83.03,73.98 83.98,73.03 92.08,73.03 RAM.8 97.47,76.2 101.28,80.01 112.87,80.01 v116.52,76.36
  Bottom 0.406: v83.03,74.3 v79.38,77.95 | ROM.8 116.68,76.2 v116.52,76.36
N$12  (via drill 0.61)
  Top 0.406: ALDEC.16 75.09,95.41 86.99,95.41 v90.33,92.08 | v90.33,83.66 RAM.7 95.41,78.74 99.22,82.55 v101.92,82.55
  Bottom 0.406: v90.33,83.66 v90.33,92.08 | ROM.7 120.81,78.74 117,82.55 v101.92,82.55
N$13  (via drill 0.61)
  Top 0.406: ALDEC.15 74.93,90.01 78.74,86.2 v78.74,81.44 | v118.59,82.55 103.5,82.55 101.92,84.14 98.11,84.14 RAM.6
  Bottom 0.406: v78.74,81.44 86.52,81.44 86.84,81.76 94.77,81.76 RAM.6 | ROM.6 119.86,81.28 v118.59,82.55
N$14  (via drill 0.61)
  Top 0.406: ALDEC.14 79.38,94.61 86.2,94.61 91.12,89.69 93.66,89.69 94.14,90.17 97,90.17 98.42,88.74 98.42,87.47 | 98.42,87.47 98.42,87 RAM.5 | v116.68,85.09 100.97,85.09 98.58,87.47 98.42,87.47
  Bottom 0.406: ROM.5 117.95,83.82 v116.68,85.09
N$15  (via drill 0.61)
  Top 0.406: ALDEC.13 86.36,86.36 RAM.4 95.41,86.36 v97.31,88.27
  Bottom 0.406: ROM.4 112.87,86.36 111.6,87.63 97.95,87.63 v97.31,88.27
N$16
  Top 0.406: ALDEC.12 86.36,88.9 RAM.3
  Bottom 0.406: ROM.3 112.87,88.9 111.6,90.17 96.52,90.17 RAM.3
N$17  (via drill 0.61)
  Top 0.406: v121.29,11.75 121.76,11.75 130.97,20.95 132.08,20.95 139.22,28.1 139.22,56.83 v138.91,57.15 | v133.83,83.19 133.83,93.03 124.46,102.39 124.46,107.47 121.92,110.01 121.92,113.03 R12.1
  Bottom 0.406: IBF.18 74.93,15.08 71.12,11.27 71.12,9.05 72.71,7.46 117,7.46 v121.29,11.75 | v138.91,57.15 139.22,57.15 141.92,59.85 141.92,70.01 139.54,72.39 137.32,72.39 133.83,75.88 v133.83,83.19
N$18  (via drill 0.61)
  Top 0.406: IBF.16 83.5,14.29 v107,14.29 | v111.28,18.57 113.51,18.57 113.82,18.89 117.32,18.89 v121.6,23.18 | v130.81,57.63 v130.81,51.44 | v130.81,67.79 130.81,71.91 v131.45,72.55 | v131.45,83.34 131.45,90.33 119.38,102.39 119.38,107.95 R13.1
  Bottom 0.406: v111.28,18.57 v107,14.29 | v121.6,23.18 121.6,25.24 129.54,33.18 129.54,50.16 v130.81,51.44 | v130.81,67.79 v130.81,57.63 | v131.45,83.34 v131.45,72.55
N$19  (via drill 0.61)
  Top 0.406: IBF.14 87.79,15.08 104.93,15.08 106.52,16.67 114.14,16.67 114.78,17.3 118.9,17.3 v127.79,26.19 | v143.35,81.76 v143.35,58.42 | v143.35,90.49 143.35,102.23 137.48,108.11 137.16,108.11 134.62,110.65 134.62,114.78 133.83,115.57 v116.2,115.57
  Bottom 0.406: v127.79,26.19 127.79,29.21 135.1,36.51 135.1,50.16 v143.35,58.42 | v143.35,90.49 v143.35,81.76 | v116.2,115.57 104.14,115.57 R14.1
N$20  (via drill 0.61)
  Top 0.406: IBF.12 92.08,15.88 103.03,15.88 104.62,17.46 113.51,17.46 114.14,18.1 118.11,18.1 v123.83,23.81 | v134.94,79.85 133.19,79.85 125.09,87.95 125.09,94.46 117.95,101.6 117.63,101.6 116.84,102.39 116.84,103.35 110.97,109.22 105.89,109.22 102.08,113.03 94.14,113.03 92.87,114.3 R15.1
  Bottom 0.406: v123.83,23.81 123.83,26.35 134.3,36.83 134.3,50.96 144.46,61.12 144.46,70.01 139.54,74.93 135.89,74.93 134.94,75.88 v134.94,79.85
N$21  (via drill 0.61)
  Top 0.406: IBF.9 94.46,5.87 134.78,5.87 v143.35,14.45 | v140.34,50.64 140.34,71.6 139.54,72.39 v135.73,72.39 | v132.72,83.98 132.72,91.44 121.92,102.23 121.92,107.16 113.51,115.57 83.82,115.57 R16.1
  Bottom 0.406: v143.35,14.45 143.35,47.62 v140.34,50.64 | v135.73,72.39 135.73,72.87 132.72,75.88 v132.72,83.98
N$22  (via drill 0.61)
  Top 0.406: v125.57,12.86 126.21,12.86 143.51,30.16 v143.51,56.99 | v144.46,89.38 144.46,102.39 v137.64,109.22
  Bottom 0.406: IBF.7 86.99,8.26 116.2,8.26 120.81,12.86 v125.57,12.86 | v143.51,56.99 145.26,58.74 145.26,88.58 v144.46,89.38 | v137.64,109.22 126.52,109.22 121.92,113.82 121.92,114.78 120.02,116.68 74.77,116.68 R17.1
N$23  (via drill 0.61)
  Top 0.406: IBF.5 74.3,15.88 v58.9,15.88
  Bottom 0.406: v58.9,15.88 56.99,17.78 33.02,17.78 10.32,40.48 10.32,82.39 43.5,115.57 55.4,115.57 57.94,113.03 60.96,113.03 R18.1
N$24  (via drill 0.61)
  Top 0.406: v75.25,21.59 75.25,20.64 IBF.19
  Bottom 0.406: IBF.1 69.85,15.24 IBF.19 | V1.6 73.66,59.69 69.85,55.88 69.85,51.59 71.6,49.85 71.6,34.92 72.39,34.13 72.39,24.29 75.09,21.59 v75.25,21.59
N$25  (via drill 0.61)
  Top 0.406: IBF.3 69.85,5.08 40.64,5.08 10.32,35.4 10.32,82.39 32.07,104.14 v44.13,104.14
  Bottom 0.406: v44.13,104.14 44.45,104.14 R19.1
N$26  (via drill 1.2 pad 1.42)
  other vias: 3.81,120.65
N$27  (via drill 1.2 pad 1.42)
  other vias: 148.59,120.65
N$28  (via drill 1.2 pad 1.42)
  other vias: 3.81,3.81
N$29  (via drill 1.2 pad 1.42)
  other vias: 147.32,3.81
N$33
  Top 0.406: SOD.A 54.13,101.6 59.85,107.31 66.67,107.31 R9.2
N$42  (via drill 0.61)
  Top 0.406: PIN.1 111.76,14.13 117,8.89 IC2.1 128.27,13.34 v133.83,18.89 | v65.88,100.49 C4.1 | v87.95,99.69 v84.93,99.69 | v128.91,57.63 128.91,53.82 129.38,53.34 POUT.1 | v127.64,32.86 v133.83,32.86
  Bottom 0.406: v65.88,100.49 84.14,100.49 v84.93,99.69 | v87.95,99.69 87.95,97.79 92.08,93.66 92.08,87.15 94.14,85.09 96.68,85.09 109.38,72.39 111.92,72.39 122.08,62.23 124.3,62.23 v128.91,57.63 | v133.83,32.86 v133.83,18.89 | v127.64,32.86 127.64,51.59 129.38,53.34 POUT.1
N$44  (via drill 0.61)
  Top 0.406: v115.25,16.19 120.81,10.64 121.76,10.64 131.29,20.16 132.4,20.16 142.56,30.32 142.56,56.36 142.24,56.67 142.24,78.26 142.56,78.58 142.56,79.53 139.54,82.55 137.32,82.55 136.53,83.34 136.53,89.38 137.32,90.17 142.08,90.17 144.15,88.11 145.1,88.11 145.73,88.74 145.73,109.54 R10.2
  Bottom 0.406: POWON.A 111.12,20.32 v115.25,16.19
N$46
  Top 0.406: V2.1 86.36,50.96 85.09,52.23 85.09,59.69 V1.2
N$50
  Bottom 0.406: V2.4 78.74,39.05 77.47,40.32 77.47,59.69 V1.4
OPLE  (via drill 0.61)
  Top 0.406: v92.39,21.91 v88.58,25.72 | v95.41,18.89 103.98,18.89 104.62,18.26 106.2,18.26 112.08,24.13 112.08,24.77 112.71,25.4 118.11,25.4 O/PLATCH.11
  Bottom 0.406: v88.58,25.72 V2.3 | v95.41,18.89 v92.39,21.91
RD  (via drill 0.61)
  Top 0.406: 8085MPU.32 49.53,68.58 SL5.5 | v78.58,48.26 74.77,48.26 73.18,49.85 71.91,49.85 71.12,50.64 63.02,50.64 56.52,57.15 49.85,57.15 48.74,56.04 47.78,56.04 47.15,56.67 47.15,62.07 46.51,62.71 v43.81,62.71
  Bottom 0.406: v78.58,48.26 CONSIG.2 | v43.81,62.71 41.75,64.77 39.53,64.77 38.73,65.56 38.73,66.67 8085MPU.32
READY  (via drill 0.61)
  Top 0.406: SL3.8 14.45,63.5 20.8,69.85 29.53,69.85 v35.88,76.2 35.88,76.36 39.53,80.01 41.75,80.01 45.24,83.5 v45.24,84.93 | v122.08,119.22 52.86,119.22 43.97,110.33 v43.97,105.57 | v45.24,96.52 v50.17,101.44
  Bottom 0.406: v35.88,76.2 8085MPU.35 | v122.08,119.22 R3.2 | v43.97,105.57 43.02,104.62 43.02,103.66 45.24,101.44 v50.17,101.44 | v45.24,84.93 v45.24,96.52
RES_IN  (via drill 0.61)
  Top 0.406: RESET.2 80.64,44.29 74.3,44.29 RESET.1 74.14,44.29 67.79,44.29 v60.01,52.07 | v50.64,52.07 46.04,56.67 v46.04,61.59 | v46.04,71.75 46.04,73.03 v49.21,76.2 | R2.2 140.02,110.49 132.4,118.11 59.21,118.11 52.07,110.97 52.07,109.38 42.23,99.54 32.54,99.54 30.8,97.79 30.8,97.16 14.92,81.28 SL3.1
  Bottom 0.406: C1.1 131.6,102.87 132.87,101.6 136.37,101.6 140.97,106.2 R2.2 | SL3.1 15.24,80.01 26.51,80.01 27.78,78.74 8085MPU.36 40.8,78.74 43.34,76.2 v49.21,76.2 | v50.64,52.07 v60.01,52.07 | v46.04,71.75 v46.04,61.59
RES_OUT
  Top 0.406: 8085MPU.3 16.03,74.45 16.03,68.1 15.24,67.31 12.7,67.31 11.91,66.52 11.91,42.7 SL4.1
RST5.5  (via drill 0.61)
  Top 0.406: R6.2 95.57,110.49 93.5,112.55 59.69,112.55 v59.05,111.92 | v52.39,114.46 51.28,115.57 50.32,115.57 45.24,110.49 45.24,103.66 41.91,100.33 30.48,100.33 11.91,81.76 11.91,73.18 SL3.5
  Bottom 0.406: 8085MPU.9 16.51,68.58 SL3.5 | v59.05,111.92 57.47,111.92 54.93,114.46 v52.39,114.46
RST6.5  (via drill 0.61)
  Top 0.406: R7.2 84.3,110.49 83.03,111.76 65.25,111.76 61.59,108.11 55.24,108.11 42.55,95.41 42.55,94.3 37.94,89.69 v37.94,87.47 | v37.94,83.03 28.89,73.98 28.89,73.66 26.35,71.12 8085MPU.8
  Bottom 0.406: 8085MPU.8 22.22,71.12 20.48,72.87 14.76,72.87 SL3.4 | v37.94,83.03 v37.94,87.47
RST7.5  (via drill 0.61)
  Top 0.406: R1.2 58.42,113.51 27.31,82.39 27.31,75.56 8085MPU.7 | v128.27,110.33 C2.2 | v30.8,48.1 46.83,32.07 53.82,32.07 INP.3
  Bottom 0.406: INP.3 53.97,32.07 60.33,32.07 INP.4 | SL3.3 16.51,73.66 8085MPU.7 25.4,73.5 30.8,68.1 v30.8,48.1 | v128.27,110.33 128.27,110.97 120.33,118.9 63.02,118.9 R1.2
S0
  Bottom 0.406: 8085MPU.29 45.08,60.96 45.56,60.48 49.05,60.48 SL5.2
S1
  Bottom 0.406: 8085MPU.33 43.81,71.12 45.56,72.87 50.32,72.87 SL5.3
SID
  Top 0.406: SENSOR.2 36.83,19.05 SL4.6
  Bottom 0.406: 8085MPU.5 32.07,72.07 32.07,33.97 33.5,32.54 34.77,32.54 SL4.6
SOD  (via drill 0.61)
  Top 0.406: v41.43,94.93 41.43,95.41 55.24,109.22 60.96,109.22 R9.1 | v20,71.75 20,75.88 8085MPU.4
  Bottom 0.406: 8085MPU.4 27.78,81.28 v41.43,94.93 | SL4.2 26.67,36.99 23.5,40.16 23.5,48.74 24.29,49.53 26.51,49.53 27.31,50.32 27.31,69.06 26.51,69.85 21.91,69.85 v20,71.75
TRAP  (via drill 0.61)
  Top 0.406: v53.97,110.65 53.97,110.17 28.89,85.09 20.32,85.09 SL3.2
  Bottom 0.406: 8085MPU.6 16.51,76.2 SL3.2 | R8.2 74.14,110.49 72.87,109.22 55.4,109.22 v53.97,110.65
VCC  (via drill 0.61)
  Top 0.406: C2.1 125.73,107.95 125.02,108.66 | R3.1 125.02,108.66 | ROM.27 ROM.28 138.43,102.71 135.89,105.25 C7.1 135.89,107.79 133.35,110.33 R2.1 R10.1 R12.2 130.65,114.3 125.02,108.66 | 8085MPU.40 58.42,88.9 ALDEC.20 62.23,95.25 C16.1 | C6.1 110.49,97.95 | 110.49,97.95 RAM.28 | C9.1 110.33,97.95 110.49,97.95 | C5.1 110.65,97.95 110.49,97.95 | SENSOR.3 34.29,27.94 SL4.4 | 56.04,36.67 60.33,36.67 INP.2 | 56.04,36.67 53.97,36.67 INP.1 | DIPSW1.9 DIPSW1.10 DIPSW1.11 DIPSW1.12 DIPSW1.13 55.88,17.78 | 55.88,17.78 DIPSW1.14 DIPSW1.15 DIPSW1.16 56.04,24.13 56.04,36.67 | 55.88,17.78 IBF.20 69.85,17.94 75.41,23.5 84.3,23.5 86.2,25.4 V2.14 86.36,29.21 CONSIG.6 | V1.14 100.33,53.34 CONSIG.16 | v68.58,73.5 v68.58,81.6
  Bottom 0.406: R3.1 123.19,111.44 120.65,113.98 R13.2 120.49,113.98 114.46,113.98 113.51,113.03 111.92,113.03 110.65,114.3 R14.2 104.62,114.3 103.35,113.03 99.22,113.03 99.14,113.11 | R19.2 60.48,110.49 64.29,114.3 R18.2 70.64,114.3 71.91,113.03 80.01,113.03 | C16.1 70.64,102.87 71.91,104.14 73.66,104.14 | C15.1 73.66,104.14 | C14.1 79.22,102.87 78.03,104.06 | 78.03,104.06 77.95,104.14 73.66,104.14 | C13.1 84.3,102.87 83.11,104.06 | 83.11,104.06 83.03,104.14 81.28,104.14 | 81.28,104.14 78.11,104.14 78.03,104.06 | C12.1 89.38,102.87 88.19,104.06 | 88.19,104.06 88.11,104.14 83.19,104.14 83.11,104.06 | C11.1 94.46,102.87 93.27,104.06 | 93.27,104.06 93.19,104.14 90.33,104.14 | 90.33,104.14 88.27,104.14 88.19,104.06 | C10.1 99.54,102.87 98.35,104.06 | 98.35,104.06 98.27,104.14 93.34,104.14 93.27,104.06 | 80.01,113.03 80.01,112.24 81.2,111.05 | 80.01,113.03 R17.2 | 81.2,111.05 81.28,110.97 81.28,104.14 | R16.2 84.45,114.3 81.2,111.05 | 99.14,113.11 90.33,104.3 90.33,104.14 | 99.14,113.11 R15.2 | C9.1 104.62,102.87 103.35,104.14 98.42,104.14 98.35,104.06 | SENSOR.3 45.88,19.05 47.15,20.32 54.61,20.32 DIPSW1.15 | IC2.3 133.35,9.21 119.7,22.86 C8.+ 116.84,33.81 116.2,34.45 116.2,51.44 116.13,51.51 | O/PLATCH.20 116.68,52.07 116.13,51.51 | 116.13,51.51 115.41,50.8 CONSIG.16 102.87,50.64 98.27,46.04 98.27,41.12 CONSIG.6 | ALDEC.20 68.58,86.36 v68.58,81.6 | v68.58,73.5 80.01,62.07 80.01,59.69 V1.14
WR  (via drill 0.61)
  Top 0.406: v44.93,69.69 48.1,69.69 SL5.6 | v78.58,45.72 67.94,45.72 v64.13,49.53 | 8085MPU.31 v34.45,59.85
  Bottom 0.406: 8085MPU.31 41.28,66.04 v44.93,69.69 | v78.58,45.72 CONSIG.3 | v64.13,49.53 39.53,49.53 34.45,54.61 v34.45,59.85
X1  (via drill 0.61)
  Top 0.406: Q1.2 33.02,96.52 8085MPU.1 | SL4.8 27.94,44.45 v19.84,44.45
  Bottom 0.406: v19.84,44.45 19.84,55.09 15.24,59.69 12.7,59.69 11.11,61.28 11.11,82.07 17.94,88.9 8085MPU.1
X2  (via drill 0.61)
  Top 0.406: Q1.1 36.83,97.79 8085MPU.2 | v87.15,100.81 70.48,100.81 63.5,93.82 63.5,91.6 61.44,89.53 v60.64,89.53 | SL4.7 30.48,39.37 23.65,39.37 v20.96,42.07
  Bottom 0.406: C3.1 119.86,102.87 117.79,100.81 v87.15,100.81 | v60.64,89.53 53.82,89.53 44.93,98.42 38.73,98.42 Q1.1 | v20.96,42.07 20.96,56.52 15.24,62.23 12.7,62.23 11.91,63.02 11.91,81.76 16.51,86.36 8085MPU.2

### Text on the board
tPlace: ABHISHEK SAGU / 09/EC/14 | POV DISPLAY | AMITESH K SINGH / 24/EC/14 | V-1.0